# EAGLE design dubBoard (EAGLE 6.5.0)
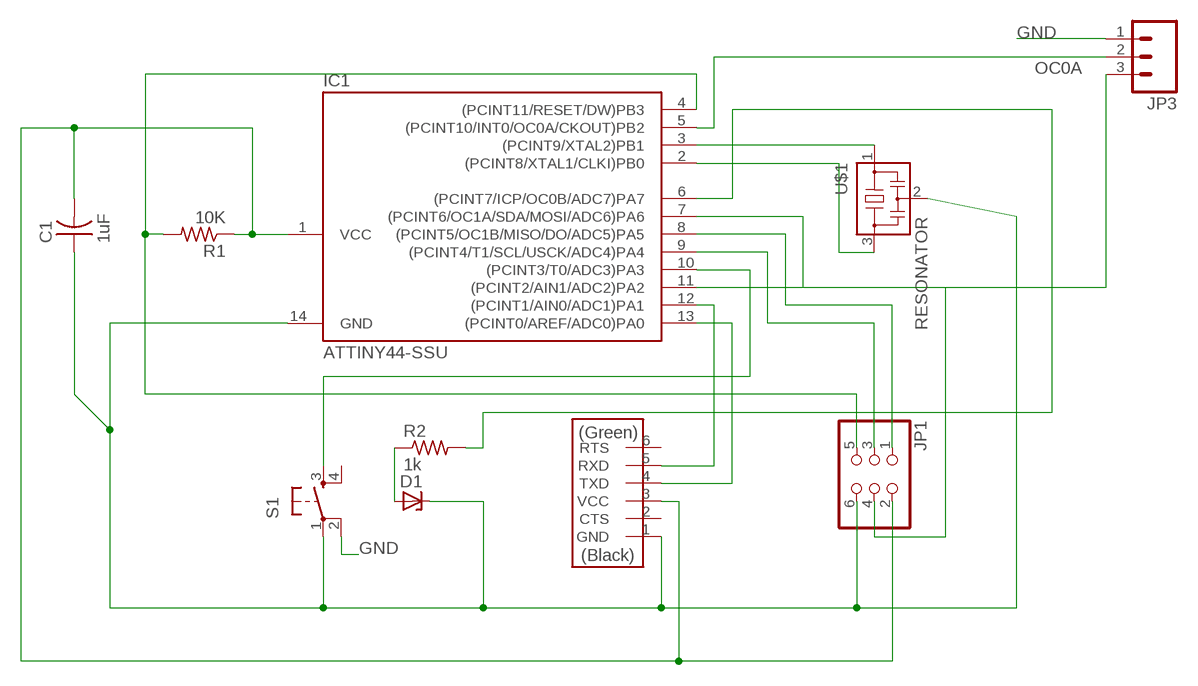
[diagram p0: schematic, sheet 1]

## Parts
C1  1uF  CAP-US1206FAB  [C1206FAB]
D1  ZENER_DIODESOD123  [SOD123]
IC1  ATTINY44-SSU  [SOIC14]
JP1  PINHD-2X3-SMD  [2X03SMD]
JP3  M03SMD_RA_MALE  [1X03_SMD_RA_MALE]
R1  10K  RES-US1206  [R1206]
R2  1k  RES-US1206FAB  [R1206FAB]
S1  6MM_SWITCH6MM_SWITCH  [6MM_SWITCH]
U$1  RESONATOR  [EFOBM]
U$2  FTDI-SMD-HEADER  [1X06SMD]

## Nets
GND: C1.1 D1.CATHODE IC1.14(GND) JP1.6 JP3.1 S1.1(P) S1.2(P1) U$1.2 U$2.1(GND)
N$1: D1.ANODE R2.1
N$2: IC1.2((PCINT8/XTAL1/CLKI)PB0) U$1.3
N$3: IC1.3((PCINT9/XTAL2)PB1) U$1.1
N$4: C1.2 IC1.1(VCC) JP1.2 R1.1 U$2.3(VCC)
N$5: IC1.4((PCINT11/RESET/DW)PB3) JP1.5 R1.2
N$6: IC1.8((PCINT5/OC1B/MISO/DO/ADC5)PA5) JP1.1
N$7: IC1.9((PCINT4/T1/SCL/USCK/ADC4)PA4) JP1.3
N$8: IC1.10((PCINT3/T0/ADC3)PA3) S1.3(S)
N$9: IC1.7((PCINT6/OC1A/SDA/MOSI/ADC6)PA6) JP1.4
N$10: IC1.6((PCINT7/ICP/OC0B/ADC7)PA7) R2.2
N$11: IC1.13((PCINT0/AREF/ADC0)PA0) U$2.4(TXD)
N$12: IC1.12((PCINT1/AIN0/ADC1)PA1) U$2.5(RXD)
N$15: IC1.11((PCINT2/AIN1/ADC2)PA2) JP3.3
OC0A: IC1.5((PCINT10/INT0/OC0A/CKOUT)PB2) JP3.2
Unconnected: S1.4(S1) U$2.2(CTS) U$2.6(RTS)

## Library data of the parts
C1 = fab:CAP-US
D1 = fab 2:ZENER_DIODE: zener diode
IC1 = fab:ATTINY44
JP1 = fab:PINHD-2X3-SMD: PIN HEADER
JP3 = SparkFun-Connectors:M03: Header 3 Standard 3-pin 0.1" header. Use with straight break away headers (SKU : PRT-00116), right angle break away headers (PRT-00553), swiss pins (PRT-00743), machine pins (PRT-00117), and female headers (PRT-00115). Molex polarized connector foot print use with SKU : PRT-08232 with associated crimp pins and housings.; PROD_ID: CONN-10925
R1 R2 = fab:RES-US: Resistor (US Symbol) Variants with postfix FAB are widened to allow the routing of internal traces
S1 = fab:6MM_SWITCH: OMRON SWITCH
U$1 = fab:RESONATOR
U$2 = fab:FTDI-SMD-HEADER

## Net classes
0 default: clearance 0.205 mm

## Board
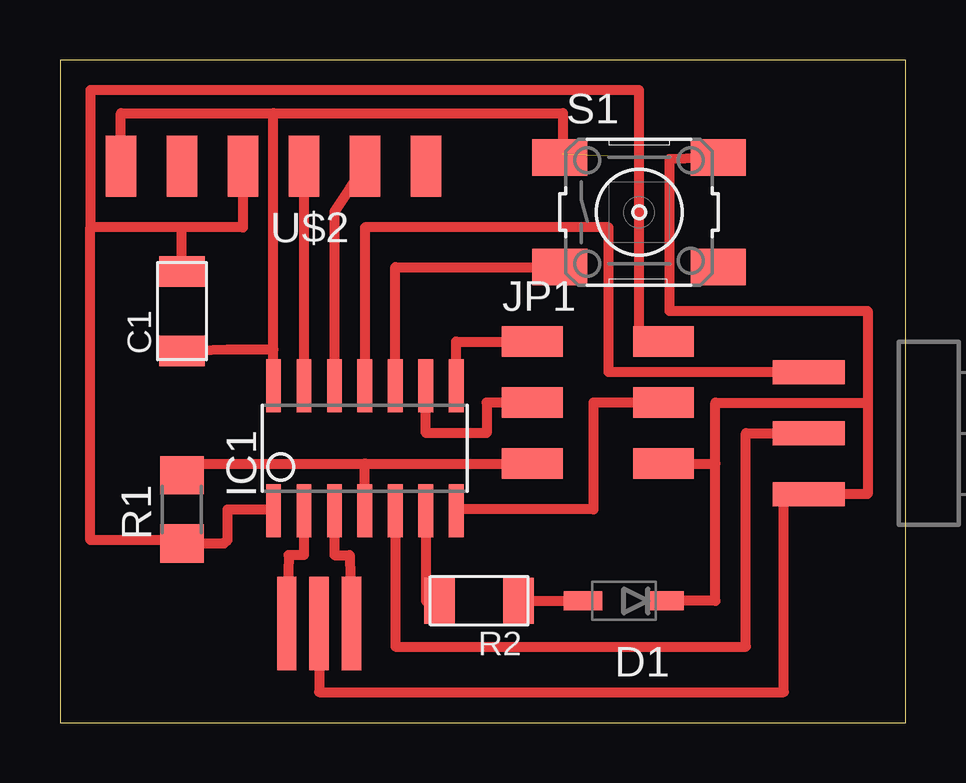
[diagram p1: board, top side]

Size 35.23 x 27.61 mm. Coordinates in mm from the lower left corner, seen from the top.
Outline: 0,0 35.23,0 35.23,27.61 0,27.61 0,0
Copper layers (1*16): Top 0.035mm / dielectric 1.5mm / Bottom 0.035mm
Design rules "default": minimum track width 10mil, minimum drill 24mil, track to track 8mil, track to pad 8mil, pad to pad 8mil, via to via 8mil, smd to smd 8mil, copper to edge 40mil, drill to drill 8mil, minimum pad ring 10mil, minimum via ring 8mil, stop-mask expansion 4mil, vias tented up to drill 0mil, thermal gap 10mil

### Footprints (pad centres in the part's own frame; a part is rotated, then mirrored left to right if it is on the bottom)
C1206FAB = smd 1.27 x 1.905: 1 -1.651,0; 2 1.651,0
SOD123 = smd 1.6 x 0.8: ANODE 1.7,0; CATHODE -1.7,0
SOIC14 = smd 0.61 x 2.21: 1 -3.81,-2.603; 2 -2.54,-2.603; 3 -1.27,-2.603; 4 0,-2.603; 5 1.27,-2.603; 6 2.54,-2.603; 7 3.81,-2.603; 8 3.81,2.603; 9 2.54,2.603; 10 1.27,2.603; 11 0,2.603; 12 -1.27,2.603; 13 -2.54,2.603; 14 -3.81,2.603
2X03SMD = smd 2.54 x 1.27: 1 -2.54,2.54; 2 2.92,2.54; 3 -2.54,0; 4 2.92,0; 5 -2.54,-2.54; 6 2.92,-2.54
1X03_SMD_RA_MALE = smd 1 x 3: 1 -2.54,5; 2 0,5; 3 2.54,5
R1206 = smd 1.6 x 1.803: 1 -1.422,0; 2 1.422,0
R1206FAB = smd 1.27 x 1.905: 1 -1.651,0; 2 1.651,0
6MM_SWITCH = smd 2.286 x 1.524: 1 -3.302,2.286; 2 3.302,2.286; 3 -3.302,-2.286; 4 3.302,-2.286
EFOBM = smd 0.8 x 3.9: 1 -1.35,0; 2 0,0; 3 1.35,0
1X06SMD = smd 2.54 x 1.27: 1 0,6.35; 2 0,3.81; 3 0,1.27; 4 0,-1.27; 5 0,-3.81; 6 0,-6.35

### Placement (x,y rotation side)
C1  5.08,17.14 90 top
D1  23.5,5.08 180 top
IC1  12.7,11.43 0 top
JP1  22.23,13.34 0 top
JP3  36.2,12.06 90 top
R1  5.08,8.89 90 top
R2  17.46,5.08 180 top
S1  24.13,21.27 0 top
U$1  10.79,4.13 180 top
U$2  8.89,23.18 90 top

### Tracks (layer width: path | path; a pad name or v marks a point on that pad's centre or on a via)
GND  (1 unrouted)
  Top 0.406: IC1.14 8.89,15.56 | 8.89,15.56 8.89,25.4 | 8.89,25.4 20.95,25.4 20.95,23.69 S1.1 | 33.66,13.34 33.66,17.14 25.4,17.14 25.4,23.5 S1.2 | 33.66,13.34 33.66,9.53 JP3.1 30.16,9.53 30.16,1.27 10.79,1.27 U$1.2 | 27.3,10.79 27.3,5.08 D1.CATHODE | 27.3,10.79 27.3,13.34 33.66,13.34 | U$2.1 2.54,25.4 8.89,25.4 | JP1.6 27.3,10.79 | C1.1 6.99,15.56 8.89,15.56
N$1
  Top 0.406: R2.1 D1.ANODE
N$2
  Top 0.406: IC1.2 10.16,6.99 9.53,6.99 U$1.3
N$3
  Top 0.406: IC1.3 11.43,6.99 12.06,6.99 U$1.1
N$4
  Top 0.406: IC1.1 8.83,8.89 6.99,8.89 6.99,7.62 6.83,7.47 R1.1 4.93,7.62 1.27,7.62 1.27,20.64 | U$2.3 7.62,20.64 5.08,20.64 | 5.08,20.64 1.27,20.64 | JP1.2 24.13,15.88 24.13,26.35 1.27,26.35 1.27,20.64 | C1.2 5.08,20.64
N$5
  Top 0.406: 12.7,10.79 5.08,10.79 R1.2 | 12.7,10.79 JP1.5 | IC1.4 12.7,10.79
N$6
  Top 0.406: IC1.8 16.51,15.88 JP1.1
N$7
  Top 0.406: JP1.3 17.78,13.34 17.78,12.06 15.24,12.06 IC1.9
N$8
  Top 0.406: IC1.10 13.97,18.98 S1.3
N$9
  Top 0.406: JP1.4 22.23,13.34 22.23,8.89 16.57,8.89 IC1.7
N$10
  Top 0.406: IC1.6 15.24,5.08 R2.2
N$11
  Top 0.406: U$2.4 IC1.13
N$12
  Top 0.406: U$2.5 11.43,21.27 IC1.12
N$15
  Top 0.406: JP3.3 22.86,14.61 22.86,20.64 12.7,20.64 IC1.11
OC0A
  Top 0.406: IC1.5 13.97,3.17 28.57,3.17 28.57,12.06 JP3.2